# EAGLE schematic schematic (EAGLE 8.6.3)
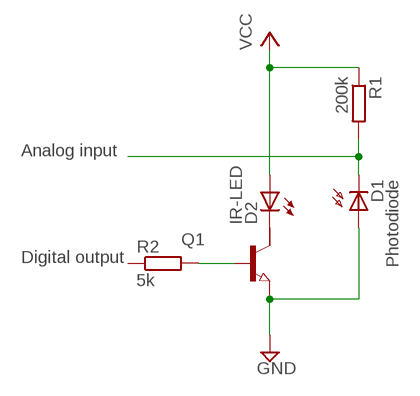
[diagram p0: schematic, sheet 1]

## Parts
D1  Photodiode  BP104  [BP104]
D2  IR-LED  SFH482  [SFH482]
Q1  NPN-TRANSISTIOR-2COLSOT89  [SOT89]
R1  200k  R-EU_0204/7  [0204/7]
R2  5k  R-EU_0204/7  [0204/7]

## Nets
GND: D1.A Q1.3(E)
N$1: D1.K(C) R1.2
N$2: D2.K(C) Q1.2(C)
N$3: Q1.1(B) R2.2
VCC: D2.A R1.1
Unconnected: Q1.2@1(C/) R2.1

## Notes on the sheet
- Analog input
- Digital output

## Library data of the parts
D1 = opto-trans-siemens:BP104: PHOTO DIODE; MF: VISHAY/TELEFUNKEN; MPN: BP104; OC_FARNELL: 1779636; OC_NEWARK: 14M4504
D2 = led:SFH482: IR LED infrared emitting diode, Infineon
Q1 = semicon-smd-ipc:NPN-TRANSISTIOR-2COL: NPN TRANSISTOR 2 colletor pins
R1 R2 = resistor:R-EU_: RESISTOR, European symbol